# Altium schematic sheet [5]-Display.SchDoc
size A3
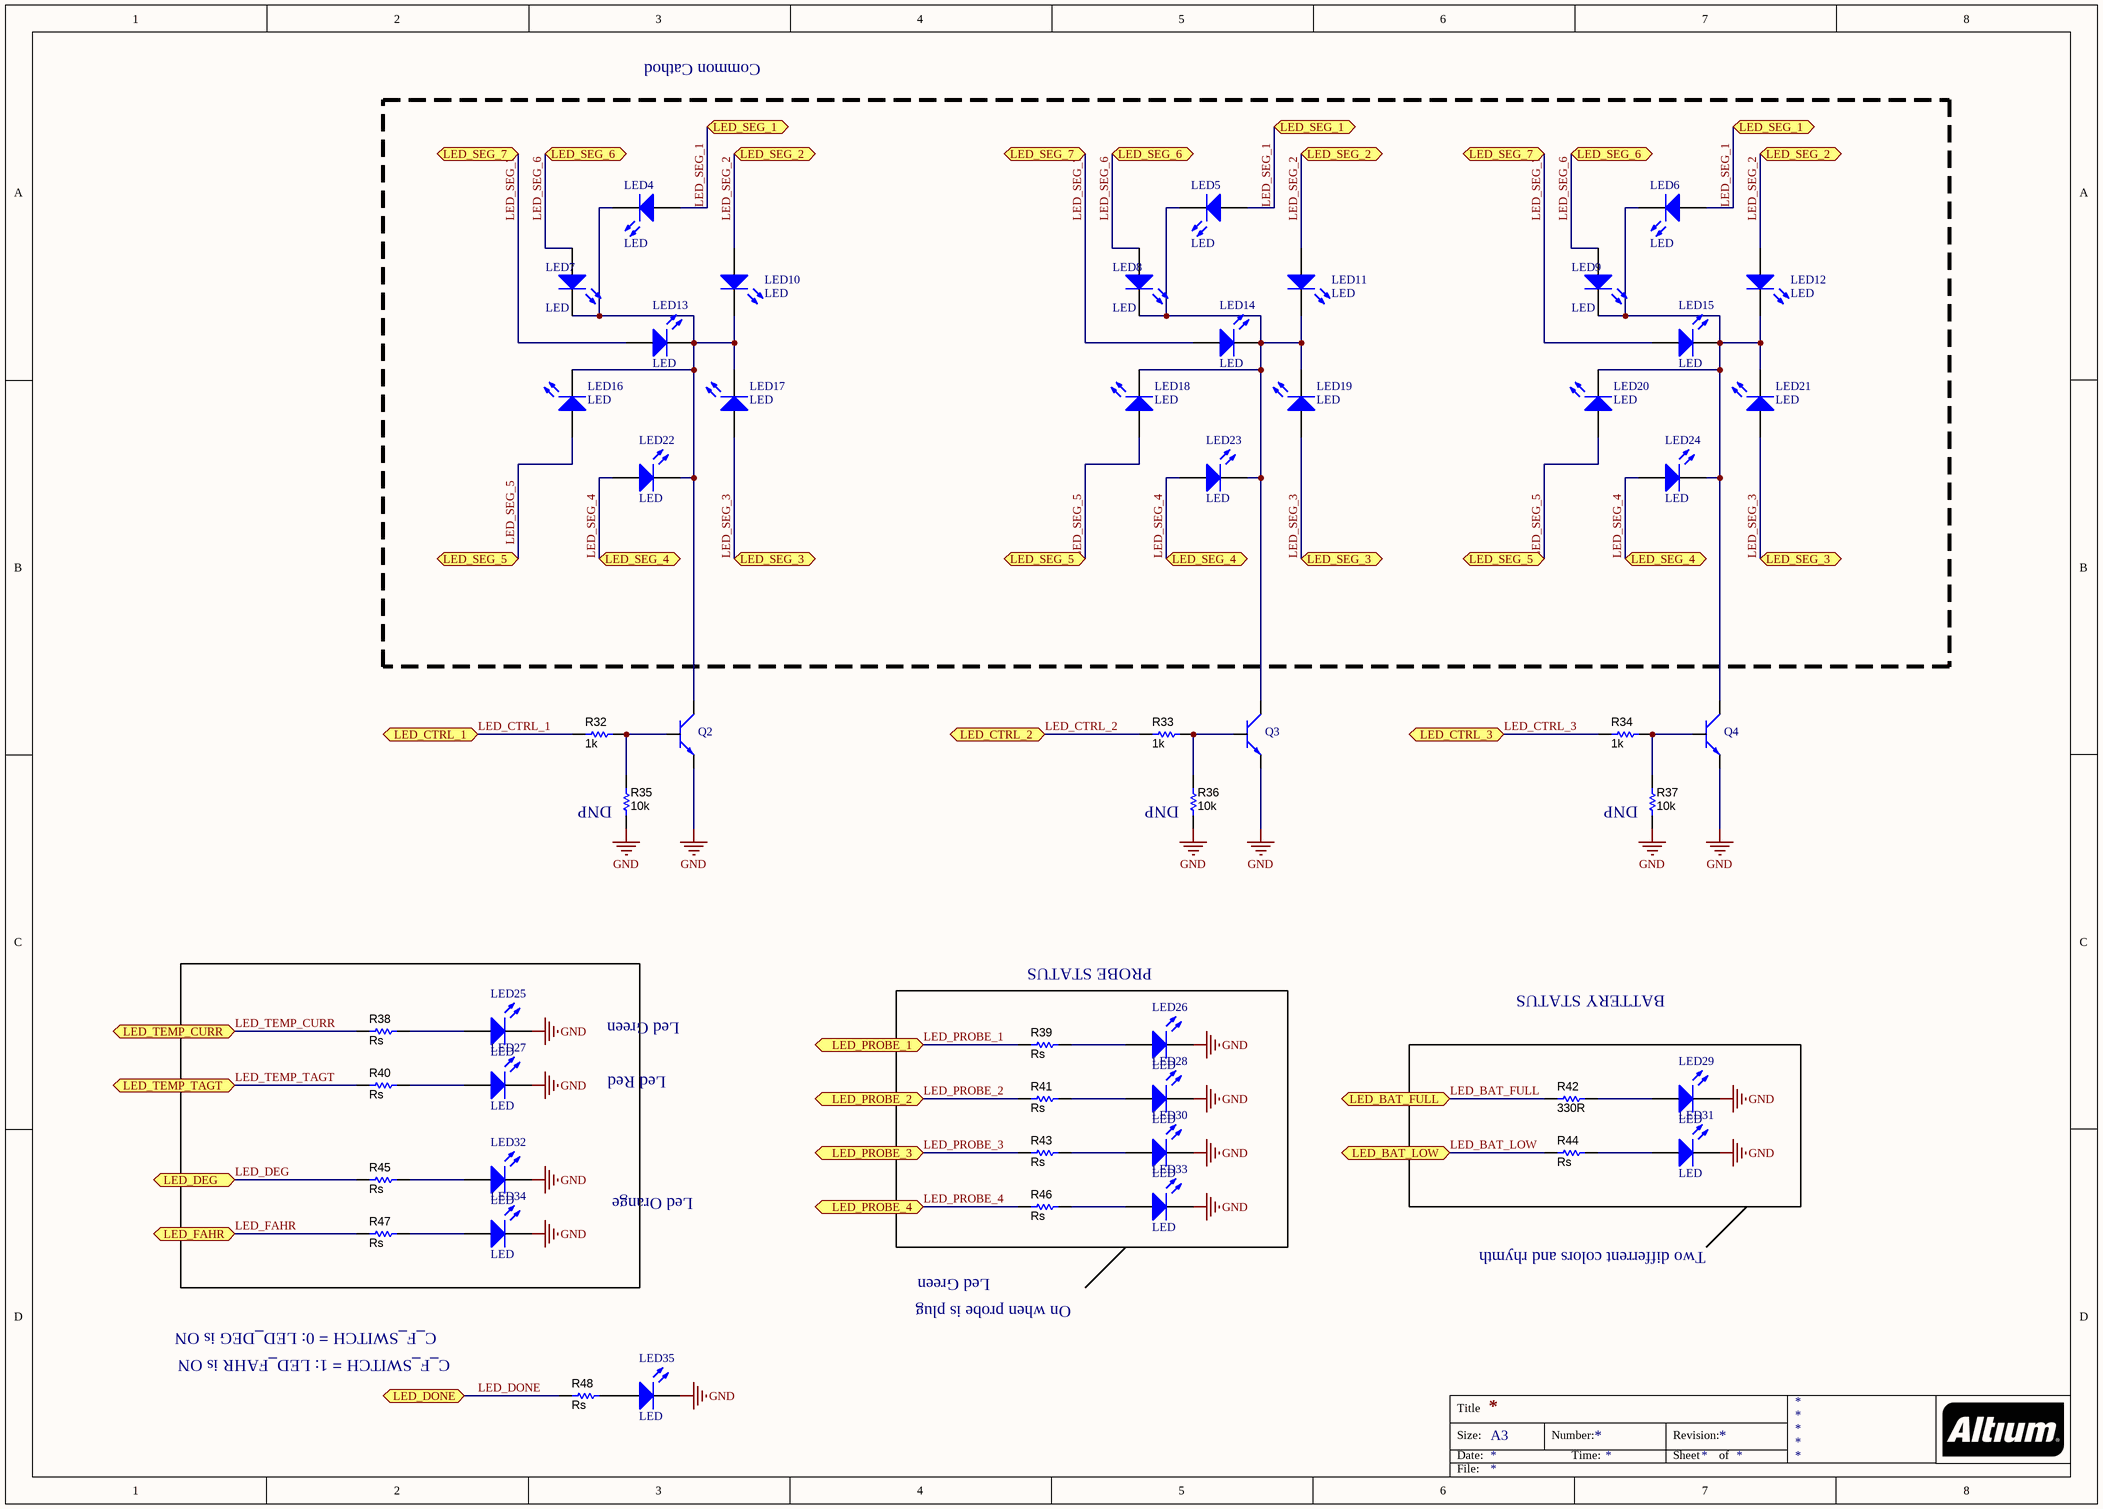
[diagram p0: [5]-Display.SchDoc]

## Parts
LED4  LED  [LED-0603-YELLOW]
LED5  LED  [LED-0603-YELLOW]
LED6  LED  [LED-0603-YELLOW]
LED7  LED  [LED-0603-YELLOW]
LED8  LED  [LED-0603-YELLOW]
LED9  LED  [LED-0603-YELLOW]
LED10  LED  [LED-0603-YELLOW]
LED11  LED  [LED-0603-YELLOW]
LED12  LED  [LED-0603-YELLOW]
LED13  LED  [LED-0603-YELLOW]
LED14  LED  [LED-0603-YELLOW]
LED15  LED  [LED-0603-YELLOW]
LED16  LED  [LED-0603-YELLOW]
LED17  LED  [LED-0603-YELLOW]
LED18  LED  [LED-0603-YELLOW]
LED19  LED  [LED-0603-YELLOW]
LED20  LED  [LED-0603-YELLOW]
LED21  LED  [LED-0603-YELLOW]
LED22  LED  [LED-0603-YELLOW]
LED23  LED  [LED-0603-YELLOW]
LED24  LED  [LED-0603-YELLOW]
LED25  LED  [LED-0603-YELLOW]
LED26  LED  [LED-0603-YELLOW]
LED27  LED  [LED-0603-YELLOW]
LED28  LED  [LED-0603-YELLOW]
LED29  LED  [LED-0603-YELLOW]
LED30  LED  [LED-0603-YELLOW]
LED31  LED  [LED-0603-YELLOW]
LED32  LED  [LED-0603-YELLOW]
LED33  LED  [LED-0603-YELLOW]
LED34  LED  [LED-0603-YELLOW]
LED35  LED  [LED-0603-YELLOW]
Q2  MMBT2222A  [SOT23A]  (value not drawn)
Q3  MMBT2222A  [SOT23A]  (value not drawn)
Q4  MMBT2222A  [SOT23A]  (value not drawn)
R32  value 1k  [0603]  (hidden comment: CRCW06031K00FKEA)
R33  value 1k  [0603]  (hidden comment: CRCW06031K00FKEA)
R34  value 1k  [0603]  (hidden comment: CRCW06031K00FKEA)
R35  value 10k  [0603]  (hidden comment: CRCW06031K00FKEA)
R36  value 10k  [0603]  (hidden comment: CRCW06031K00FKEA)
R37  value 10k  [0603]  (hidden comment: CRCW06031K00FKEA)
R38  value Rs  [0603]  (hidden comment: CRCW06031K00FKEA)
R39  value Rs  [0603]  (hidden comment: CRCW06031K00FKEA)
R40  value Rs  [0603]  (hidden comment: CRCW06031K00FKEA)
R41  value Rs  [0603]  (hidden comment: CRCW06031K00FKEA)
R42  value 330R  [0603]  (hidden comment: CRCW06031K00FKEA)
R43  value Rs  [0603]  (hidden comment: CRCW06031K00FKEA)
R44  value Rs  [0603]  (hidden comment: CRCW06031K00FKEA)
R45  value Rs  [0603]  (hidden comment: CRCW06031K00FKEA)
R46  value Rs  [0603]  (hidden comment: CRCW06031K00FKEA)
R47  value Rs  [0603]  (hidden comment: CRCW06031K00FKEA)
R48  value Rs  [0603]  (hidden comment: CRCW06031K00FKEA)

## Ports
LED_BAT_FULL (bidir), LED_BAT_LOW (bidir), LED_CTRL_1 (bidir), LED_CTRL_2 (bidir), LED_CTRL_3 (bidir), LED_DEG (bidir), LED_DONE (bidir), LED_FAHR (bidir), LED_PROBE_1 (bidir), LED_PROBE_2 (bidir), LED_PROBE_3 (bidir), LED_PROBE_4 (bidir), LED_SEG_1 (bidir), LED_SEG_2 (bidir), LED_SEG_3 (bidir), LED_SEG_4 (bidir), LED_SEG_5 (bidir), LED_SEG_6 (bidir), LED_SEG_7 (bidir), LED_TEMP_CURR (bidir), LED_TEMP_TAGT (bidir)

## Nets
GND: LED25.2(K) LED26.2(K) LED27.2(K) LED28.2(K) LED29.2(K) LED30.2(K) LED31.2(K) LED32.2(K) LED33.2(K) LED34.2(K) LED35.2(K) Q2.2(E) Q3.2(E) Q4.2(E) R35.1 R36.1 R37.1
LED_BAT_FULL: R42.2 ; port LED_BAT_FULL
LED_BAT_LOW: R44.2 ; port LED_BAT_LOW
LED_CTRL_1: R32.1 ; port LED_CTRL_1
LED_CTRL_2: R33.1 ; port LED_CTRL_2
LED_CTRL_3: R34.1 ; port LED_CTRL_3
LED_DEG: R45.2 ; port LED_DEG
LED_DONE: R48.2 ; port LED_DONE
LED_FAHR: R47.2 ; port LED_FAHR
LED_PROBE_1: R39.2 ; port LED_PROBE_1
LED_PROBE_2: R41.2 ; port LED_PROBE_2
LED_PROBE_3: R43.2 ; port LED_PROBE_3
LED_PROBE_4: R46.2 ; port LED_PROBE_4
LED_SEG_1: LED4.1(A) LED5.1(A) LED6.1(A) ; port LED_SEG_1
LED_SEG_2: LED10.1(A) LED11.1(A) LED12.1(A) ; port LED_SEG_2
LED_SEG_3: LED17.1(A) LED19.1(A) LED21.1(A) ; port LED_SEG_3
LED_SEG_4: LED22.1(A) LED23.1(A) LED24.1(A) ; port LED_SEG_4
LED_SEG_5: LED16.1(A) LED18.1(A) LED20.1(A) ; port LED_SEG_5
LED_SEG_6: LED7.1(A) LED8.1(A) LED9.1(A) ; port LED_SEG_6
LED_SEG_7: LED13.1(A) LED14.1(A) LED15.1(A) ; port LED_SEG_7
LED_TEMP_CURR: R38.2 ; port LED_TEMP_CURR
LED_TEMP_TAGT: R40.2 ; port LED_TEMP_TAGT
NetLED4_2: LED4.2(K) LED7.2(K) LED10.2(K) LED13.2(K) LED16.2(K) LED17.2(K) LED22.2(K) Q2.3(C)
NetLED5_2: LED5.2(K) LED8.2(K) LED11.2(K) LED14.2(K) LED18.2(K) LED19.2(K) LED23.2(K) Q3.3(C)
NetLED6_2: LED6.2(K) LED9.2(K) LED12.2(K) LED15.2(K) LED20.2(K) LED21.2(K) LED24.2(K) Q4.3(C)
NetLED25_1: LED25.1(A) R38.1
NetLED26_1: LED26.1(A) R39.1
NetLED27_1: LED27.1(A) R40.1
NetLED28_1: LED28.1(A) R41.1
NetLED29_1: LED29.1(A) R42.1
NetLED30_1: LED30.1(A) R43.1
NetLED31_1: LED31.1(A) R44.1
NetLED32_1: LED32.1(A) R45.1
NetLED33_1: LED33.1(A) R46.1
NetLED34_1: LED34.1(A) R47.1
NetLED35_1: LED35.1(A) R48.1
NetQ2_1: Q2.1(B) R32.2 R35.2
NetQ3_1: Q3.1(B) R33.2 R36.2
NetQ4_1: Q4.1(B) R34.2 R37.2

## Notes on the sheet
- Common Cathod
- (near R35) DNP
- (near R36) DNP
- (near R37) DNP
- PROBE STATUS
- BATTERY STATUS
- Led Green
- Led Red
- Led Orange
- Two differrent colors and rhymth
- C_F_SWITCH = 0: LED_DEG is ON
- On when probe is plug
- C_F_SWITCH = 1: LED_FAHR is ON
- Title
- Size:
- Date:
- A3
- Number:
- Time:
- Revision:
- Sheet
- of
- File:

## Library data of the parts
LED4-LED35 = LED: Typical INFRARED GaAs LED; Published: 8-Jun-2000; LatestRevisionDate: 08-Jul-2005; LatestRevisionNote: Mech Layer 1 removed.; PackageReference: LED-0; Publisher: Altium Limited; PackageDescription: LED; 2 Leads
Q2-Q4 = MMBT2222A: NPN switching transistor  40V 600mA SOT23; Manufacturer: Fairchild; Ic: 1000mA; Name: MMBT2222; Vce: 40V; Datasheet: http://www.farnell.com/datasheets/1842966.pdf; Footprint: SOT23
R32-R48 = R0603: RES, 1.00k ohm, 1%, 0.1W, 0603; Manufacturer: Vishay-Dale; Alternate Manufacturer: Any; Alternate PartNumber: Equivalent; CompType: Resistor; Res_ohm: 1000; Value_Code: 1k00; Tolerance_%: 1; Power_W: 0.1; VDC_V: 75; TempCo: 100 ppm/C; EIA_Code: E96; U/M: EA; SymbolVersion: 2009-05-29; PartNumber: CRCW06031K00FKEA; PackageReference: 0603; RoHS: Y; Value1: 1%; Value2: 0.1W; MountType: SMT; Technology: Thick Film; Published: 2008-06-26; Publisher: Texas Instruments; LatestRevisionDate: 2012-10-04; LatestRevisionNote: Changed publisher; ComponentLink1Description: Datasheet link; ComponentLink1URL: http://www.vishay.com/docs/20035/dcrcwe3.pdf; Supplier 1: Digi-Key; Supplier Part Number 1: 541-1.00KHCT-ND; Supplier 2: Farnell; Supplier Part Number 2: 1151593; Supplier 3: Newark; Supplier Part Number 3: 52K8015